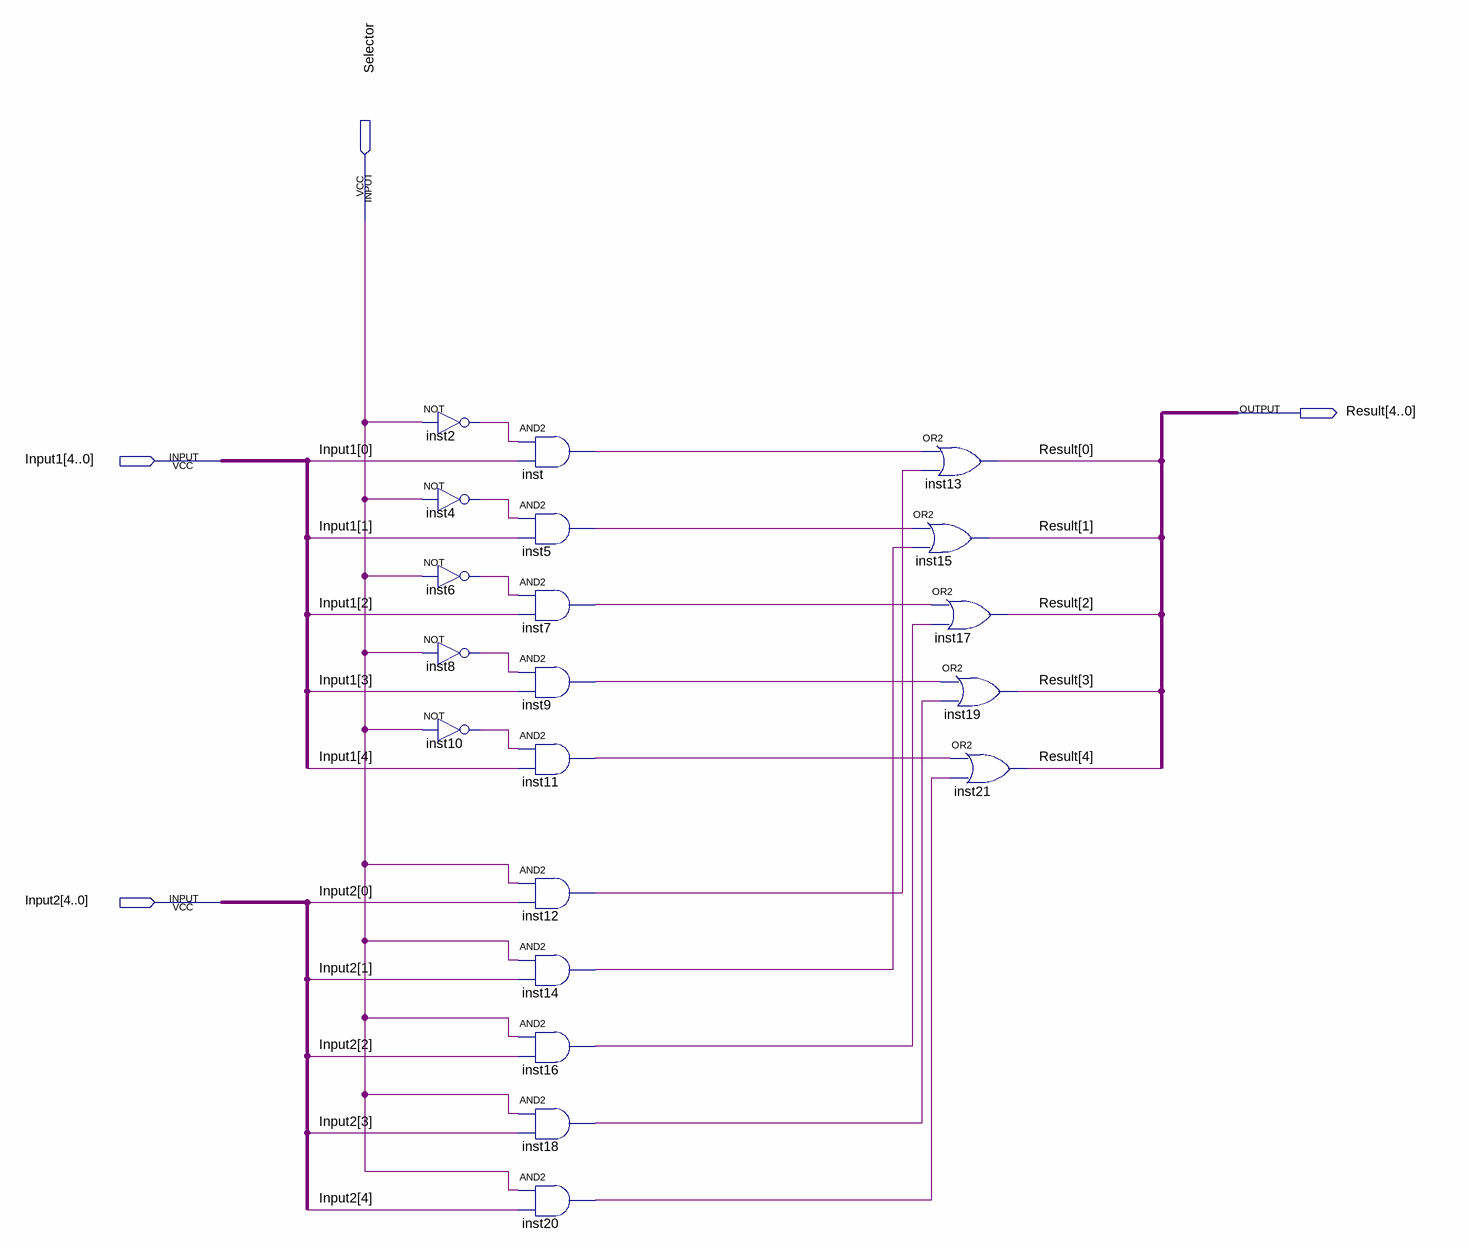
[diagram p0: schematic sheet]
// Quartus schematic mux2_5bit.bdf as structural Verilog: 20 symbols, 4 pins
module mux2_5bit (
  input  Selector,
  input  [4:0] Input1,
  input  [4:0] Input2,
  output [4:0] Result
);

  wire inst2_out, inst4_out, inst5_out, inst6_out, inst7_out, inst8_out, inst9_out, inst10_out, inst11_out,
       inst12_out, inst14_out, inst16_out, inst18_out, inst20_out, inst_out;

  not inst2 (inst2_out, Selector);
  not inst4 (inst4_out, Selector);
  not inst6 (inst6_out, Selector);
  not inst8 (inst8_out, Selector);
  not inst10 (inst10_out, Selector);
  and inst (inst_out, inst2_out, Input1[0]);
  and inst5 (inst5_out, inst4_out, Input1[1]);
  and inst7 (inst7_out, inst6_out, Input1[2]);
  and inst9 (inst9_out, inst8_out, Input1[3]);
  and inst11 (inst11_out, inst10_out, Input1[4]);
  and inst12 (inst12_out, Selector, Input2[0]);
  and inst14 (inst14_out, Selector, Input2[1]);
  and inst16 (inst16_out, Selector, Input2[2]);
  and inst18 (inst18_out, Selector, Input2[3]);
  and inst20 (inst20_out, Selector, Input2[4]);
  or inst13 (Result[0], inst_out, inst12_out);
  or inst15 (Result[1], inst5_out, inst14_out);
  or inst17 (Result[2], inst7_out, inst16_out);
  or inst19 (Result[3], inst9_out, inst18_out);
  or inst21 (Result[4], inst11_out, inst20_out);
endmodule
